# Altium schematic sheet Ring 5_D.SchDoc
size A; DocumentNumber: 16; SheetNumber: 25; SheetTotal: 30
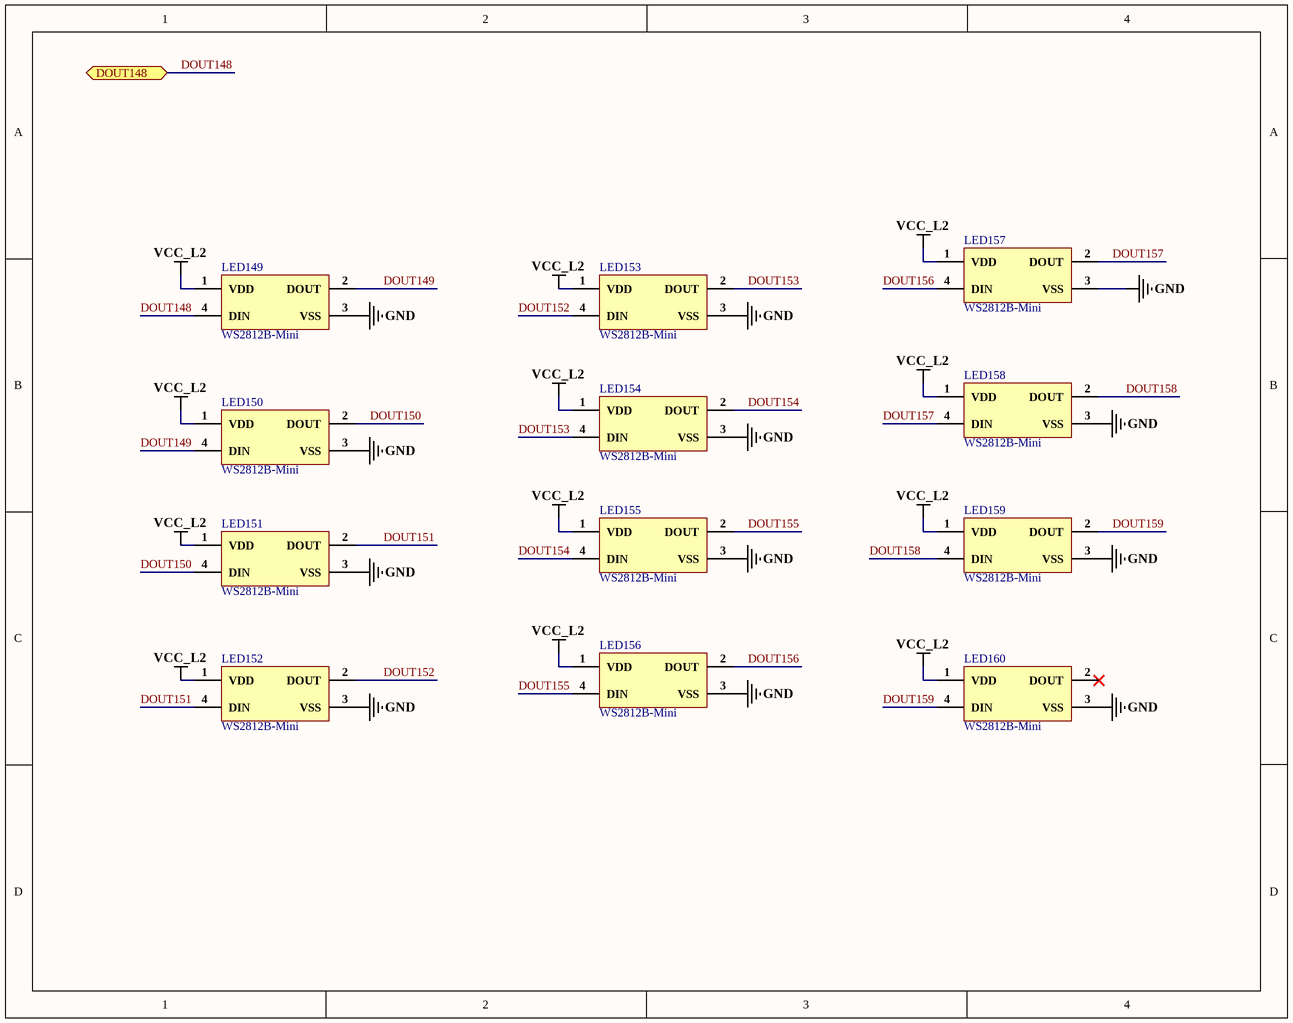
[diagram p0: Ring 5_D.SchDoc]

## Parts
LED149  WS2812B-Mini  [WS2812B-Mini]
LED150  WS2812B-Mini  [WS2812B-Mini]
LED151  WS2812B-Mini  [WS2812B-Mini]
LED152  WS2812B-Mini  [WS2812B-Mini]
LED153  WS2812B-Mini  [WS2812B-Mini]
LED154  WS2812B-Mini  [WS2812B-Mini]
LED155  WS2812B-Mini  [WS2812B-Mini]
LED156  WS2812B-Mini  [WS2812B-Mini]
LED157  WS2812B-Mini  [WS2812B-Mini]
LED158  WS2812B-Mini  [WS2812B-Mini]
LED159  WS2812B-Mini  [WS2812B-Mini]
LED160  WS2812B-Mini  [WS2812B-Mini]

## Ports
DOUT148 (bidir)

## Nets
GND: LED149.3(VSS) LED150.3(VSS) LED151.3(VSS) LED152.3(VSS) LED153.3(VSS) LED154.3(VSS) LED155.3(VSS) LED156.3(VSS) LED157.3(VSS) LED158.3(VSS) LED159.3(VSS) LED160.3(VSS)
VCC_L2: LED149.1(VDD) LED150.1(VDD) LED151.1(VDD) LED152.1(VDD) LED153.1(VDD) LED154.1(VDD) LED155.1(VDD) LED156.1(VDD) LED157.1(VDD) LED158.1(VDD) LED159.1(VDD) LED160.1(VDD)
DOUT148: LED149.4(DIN) ; port DOUT148
DOUT149: LED149.2(DOUT) LED150.4(DIN)
DOUT150: LED150.2(DOUT) LED151.4(DIN)
DOUT151: LED151.2(DOUT) LED152.4(DIN)
DOUT152: LED152.2(DOUT) LED153.4(DIN)
DOUT153: LED153.2(DOUT) LED154.4(DIN)
DOUT154: LED154.2(DOUT) LED155.4(DIN)
DOUT155: LED155.2(DOUT) LED156.4(DIN)
DOUT156: LED156.2(DOUT) LED157.4(DIN)
DOUT157: LED157.2(DOUT) LED158.4(DIN)
DOUT158: LED158.2(DOUT) LED159.4(DIN)
DOUT159: LED159.2(DOUT) LED160.4(DIN)

Not connected (* = marked no-connect by the designer): LED160 2(DOUT)*

## Library data of the parts
LED149-LED160 = WS2812B-Mini: SMD,3.5x3.5mm Light Emitting Diodes (LED) RoHS; Manufacturer: Worldsemi; ComponentLink1Description: LCSC; ComponentLink1URL: *https://lcsc.com/product-detail/Light-Emitting-Diodes-LED_Worldsemi-WS2812B-Mini_C527089.html; Package: SMD,3.5x3.5mm; Parameter 1: *